# Altium project GN-1846-E-V2_HI3531A.PRJPCB (part 5 of 5)
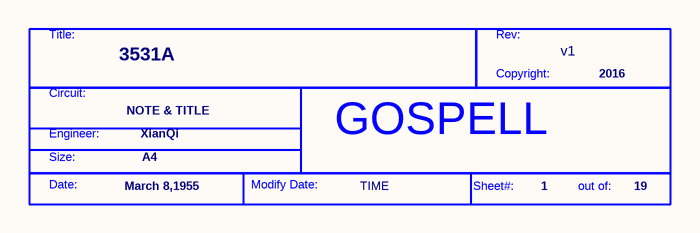
[diagram p117: P01 NOTE $ TITLE.SchDoc]

### Notes on the sheet
- (in symbol GOSPELL) Title:; Rev:; Copyright:; Circuit:; Engineer:; Size:; Date:; Modify Date:; Sheet#:; out of:

## Nets that join several sheets
1V5: P10 DDRC&D NOVTT (73 pins), P09 DDRA&B NOVTT (74 pins), P08 Hi3531AV100(DDRC0 D (42 pins), P05 Power Supply2 (7 pins)
3V3: P17 Hi3531AV100 (AD) (12 pins), P16 Hi3531AV100(RGMII&I (5 pins), P15 Hi3531AV100(VO&I2S3 (7 pins), P14 Hi3531AV100(SATA&PC (5 pins), P13 Configuration (13 pins), P12 SPI&NAND FLASH (6 pins), P11 Hi3531A(SYSTEM)&RES (18 pins), P08 Hi3531AV100(DDRC0 D (LB1.1 LB2.1), P07 Hi3531AV100(POWER) (22 pins), P05 Power Supply2 (8 pins), P04 Power Supply1 (R35.1)
12V0: P05 Power Supply2 (8 pins), P04 Power Supply1 (17 pins)
12V0IN: P18 CONNECT DDR1 (6 pins), P04 Power Supply1 (F1.1)
DDR0_A0: P09 DDRA&B NOVTT (U15.N3 U37.N3), P08 Hi3531AV100(DDRC0 D (U8.AE3)
DDR0_A1: P09 DDRA&B NOVTT (U15.P7 U37.P7), P08 Hi3531AV100(DDRC0 D (U8.AG3)
DDR0_A2: P09 DDRA&B NOVTT (U15.P3 U37.P3), P08 Hi3531AV100(DDRC0 D (U8.AK2)
DDR0_A3: P09 DDRA&B NOVTT (U15.N2 U37.N2), P08 Hi3531AV100(DDRC0 D (U8.AH3)
DDR0_A4: P09 DDRA&B NOVTT (U15.P8 U37.P8), P08 Hi3531AV100(DDRC0 D (U8.AF4)
DDR0_A5: P09 DDRA&B NOVTT (U15.P2 U37.P2), P08 Hi3531AV100(DDRC0 D (U8.AJ1)
DDR0_A6: P09 DDRA&B NOVTT (U15.R8 U37.R8), P08 Hi3531AV100(DDRC0 D (U8.AF5)
DDR0_A7: P09 DDRA&B NOVTT (U15.R2 U37.R2), P08 Hi3531AV100(DDRC0 D (U8.AK1)
DDR0_A8: P09 DDRA&B NOVTT (U15.T8 U37.T8), P08 Hi3531AV100(DDRC0 D (U8.AJ3)
DDR0_A9: P09 DDRA&B NOVTT (U15.R3 U37.R3), P08 Hi3531AV100(DDRC0 D (U8.AK3)
DDR0_A10: P09 DDRA&B NOVTT (U15.L7 U37.L7), P08 Hi3531AV100(DDRC0 D (U8.AD6)
DDR0_A11: P09 DDRA&B NOVTT (U15.R7 U37.R7), P08 Hi3531AV100(DDRC0 D (U8.AG4)
DDR0_A12: P09 DDRA&B NOVTT (U15.N7 U37.N7), P08 Hi3531AV100(DDRC0 D (U8.AE5)
DDR0_A13: P09 DDRA&B NOVTT (U15.T3 U37.T3), P08 Hi3531AV100(DDRC0 D (U8.AM1)
DDR0_A14: P09 DDRA&B NOVTT (U15.T7 U37.T7), P08 Hi3531AV100(DDRC0 D (U8.AJ4)
DDR0_A15: P09 DDRA&B NOVTT (U15.M7 U37.M7), P08 Hi3531AV100(DDRC0 D (U8.AE6)
DDR0_BA0: P09 DDRA&B NOVTT (U15.M2 U37.M2), P08 Hi3531AV100(DDRC0 D (U8.AL2)
DDR0_BA1: P09 DDRA&B NOVTT (U15.N8 U37.N8), P08 Hi3531AV100(DDRC0 D (U8.AF1)
DDR0_BA2: P09 DDRA&B NOVTT (U15.M3 U37.M3), P08 Hi3531AV100(DDRC0 D (U8.AH1)
DDR0_CAS_N: P09 DDRA&B NOVTT (U15.K3 U37.K3), P08 Hi3531AV100(DDRC0 D (U8.AD5)
DDR0_CKE: P09 DDRA&B NOVTT (U15.K9 U37.K9), P08 Hi3531AV100(DDRC0 D (U8.AF2)
DDR0_CLK0_N: P09 DDRA&B NOVTT (R292.2 U15.K7 U37.K7), P08 Hi3531AV100(DDRC0 D (U8.AE1)
DDR0_CLK0_P: P09 DDRA&B NOVTT (R292.1 U15.J7 U37.J7), P08 Hi3531AV100(DDRC0 D (U8.AE2)
DDR0_CS_N: P09 DDRA&B NOVTT (R267.1 R268.2 U15.L2 U37.L2), P08 Hi3531AV100(DDRC0 D (U8.AG1)
DDR0_DM0: P09 DDRA&B NOVTT (U15.E7), P08 Hi3531AV100(DDRC0 D (U8.R4)
DDR0_DM1: P09 DDRA&B NOVTT (U15.D3), P08 Hi3531AV100(DDRC0 D (U8.N3)
DDR0_DM2: P09 DDRA&B NOVTT (U37.E7), P08 Hi3531AV100(DDRC0 D (U8.AA5)
DDR0_DM3: P09 DDRA&B NOVTT (U37.D3), P08 Hi3531AV100(DDRC0 D (U8.W6)
DDR0_DQ0: P09 DDRA&B NOVTT (U15.E3), P08 Hi3531AV100(DDRC0 D (U8.M5)
DDR0_DQ1: P09 DDRA&B NOVTT (U15.F7), P08 Hi3531AV100(DDRC0 D (U8.R5)
DDR0_DQ2: P09 DDRA&B NOVTT (U15.F2), P08 Hi3531AV100(DDRC0 D (U8.N5)
DDR0_DQ3: P09 DDRA&B NOVTT (U15.F8), P08 Hi3531AV100(DDRC0 D (U8.U6)
DDR0_DQ4: P09 DDRA&B NOVTT (U15.H3), P08 Hi3531AV100(DDRC0 D (U8.P6)
DDR0_DQ5: P09 DDRA&B NOVTT (U15.H8), P08 Hi3531AV100(DDRC0 D (U8.U3)
DDR0_DQ6: P09 DDRA&B NOVTT (U15.G2), P08 Hi3531AV100(DDRC0 D (U8.N4)
DDR0_DQ7: P09 DDRA&B NOVTT (U15.H7), P08 Hi3531AV100(DDRC0 D (U8.P4)
DDR0_DQ8: P09 DDRA&B NOVTT (U15.D7), P08 Hi3531AV100(DDRC0 D (U8.T5)
DDR0_DQ9: P09 DDRA&B NOVTT (U15.C3), P08 Hi3531AV100(DDRC0 D (U8.N1)
DDR0_DQ10: P09 DDRA&B NOVTT (U15.C8), P08 Hi3531AV100(DDRC0 D (U8.U4)
DDR0_DQ11: P09 DDRA&B NOVTT (U15.C2), P08 Hi3531AV100(DDRC0 D (U8.M6)
DDR0_DQ12: P09 DDRA&B NOVTT (U15.A7), P08 Hi3531AV100(DDRC0 D (U8.T2)
DDR0_DQ13: P09 DDRA&B NOVTT (U15.A2), P08 Hi3531AV100(DDRC0 D (U8.M1)
DDR0_DQ14: P09 DDRA&B NOVTT (U15.B8), P08 Hi3531AV100(DDRC0 D (U8.U1)
DDR0_DQ15: P09 DDRA&B NOVTT (U15.A3), P08 Hi3531AV100(DDRC0 D (U8.M2)
DDR0_DQ16: P09 DDRA&B NOVTT (U37.E3), P08 Hi3531AV100(DDRC0 D (U8.W5)
DDR0_DQ17: P09 DDRA&B NOVTT (U37.F7), P08 Hi3531AV100(DDRC0 D (U8.Y4)
DDR0_DQ18: P09 DDRA&B NOVTT (U37.F2), P08 Hi3531AV100(DDRC0 D (U8.V2)
DDR0_DQ19: P09 DDRA&B NOVTT (U37.F8), P08 Hi3531AV100(DDRC0 D (U8.AB6)
DDR0_DQ20: P09 DDRA&B NOVTT (U37.H3), P08 Hi3531AV100(DDRC0 D (U8.V6)
DDR0_DQ21: P09 DDRA&B NOVTT (U37.H8), P08 Hi3531AV100(DDRC0 D (U8.AD1)
DDR0_DQ22: P09 DDRA&B NOVTT (U37.G2), P08 Hi3531AV100(DDRC0 D (U8.V1)
DDR0_DQ23: P09 DDRA&B NOVTT (U37.H7), P08 Hi3531AV100(DDRC0 D (U8.Y6)
DDR0_DQ24: P09 DDRA&B NOVTT (U37.D7), P08 Hi3531AV100(DDRC0 D (U8.AB4)
DDR0_DQ25: P09 DDRA&B NOVTT (U37.C3), P08 Hi3531AV100(DDRC0 D (U8.V5)
DDR0_DQ26: P09 DDRA&B NOVTT (U37.C8), P08 Hi3531AV100(DDRC0 D (U8.AB2)
DDR0_DQ27: P09 DDRA&B NOVTT (U37.C2), P08 Hi3531AV100(DDRC0 D (U8.W2)
DDR0_DQ28: P09 DDRA&B NOVTT (U37.A7), P08 Hi3531AV100(DDRC0 D (U8.AC1)
DDR0_DQ29: P09 DDRA&B NOVTT (U37.A2), P08 Hi3531AV100(DDRC0 D (U8.W3)
DDR0_DQ30: P09 DDRA&B NOVTT (U37.B8), P08 Hi3531AV100(DDRC0 D (U8.AC2)
DDR0_DQ31: P09 DDRA&B NOVTT (U37.A3), P08 Hi3531AV100(DDRC0 D (U8.W4)
DDR0_DQS0_N: P09 DDRA&B NOVTT (U15.G3), P08 Hi3531AV100(DDRC0 D (U8.P2)
DDR0_DQS0_P: P09 DDRA&B NOVTT (U15.F3), P08 Hi3531AV100(DDRC0 D (U8.P1)
DDR0_DQS1_N: P09 DDRA&B NOVTT (U15.B7), P08 Hi3531AV100(DDRC0 D (U8.R3)
DDR0_DQS1_P: P09 DDRA&B NOVTT (U15.C7), P08 Hi3531AV100(DDRC0 D (U8.R2)
DDR0_DQS2_N: P09 DDRA&B NOVTT (U37.G3), P08 Hi3531AV100(DDRC0 D (U8.Y2)
DDR0_DQS2_P: P09 DDRA&B NOVTT (U37.F3), P08 Hi3531AV100(DDRC0 D (U8.Y1)
DDR0_DQS3_N: P09 DDRA&B NOVTT (U37.B7), P08 Hi3531AV100(DDRC0 D (U8.AA3)
DDR0_DQS3_P: P09 DDRA&B NOVTT (U37.C7), P08 Hi3531AV100(DDRC0 D (U8.AA2)
DDR0_ODT: P09 DDRA&B NOVTT (R269.1 R270.2 U15.K1 U37.K1), P08 Hi3531AV100(DDRC0 D (U8.AH2)
DDR0_RAS_N: P09 DDRA&B NOVTT (U15.J3 U37.J3), P08 Hi3531AV100(DDRC0 D (U8.AG2)
DDR0_RESET_N: P09 DDRA&B NOVTT (C471.1 R235.2 U15.T2 U37.T2), P08 Hi3531AV100(DDRC0 D (U8.AL1)
DDR0_WE_N: P09 DDRA&B NOVTT (U15.L3 U37.L3), P08 Hi3531AV100(DDRC0 D (U8.AD4)
DDR1_A0: P10 DDRC&D NOVTT (U38.N3 U39.N3), P08 Hi3531AV100(DDRC0 D (U8.AH17)
DDR1_A1: P10 DDRC&D NOVTT (U38.P7 U39.P7), P08 Hi3531AV100(DDRC0 D (U8.AK19)
DDR1_A2: P10 DDRC&D NOVTT (U38.P3 U39.P3), P08 Hi3531AV100(DDRC0 D (U8.AM20)
DDR1_A3: P10 DDRC&D NOVTT (U38.N2 U39.N2), P08 Hi3531AV100(DDRC0 D (U8.AM19)
DDR1_A4: P10 DDRC&D NOVTT (U38.P8 U39.P8), P08 Hi3531AV100(DDRC0 D (U8.AH19)
DDR1_A5: P10 DDRC&D NOVTT (U38.P2 U39.P2), P08 Hi3531AV100(DDRC0 D (U8.AL20)
DDR1_A6: P10 DDRC&D NOVTT (U38.R8 U39.R8), P08 Hi3531AV100(DDRC0 D (U8.AJ19)
DDR1_A7: P10 DDRC&D NOVTT (U38.R2 U39.R2), P08 Hi3531AV100(DDRC0 D (U8.AL21)
DDR1_A8: P10 DDRC&D NOVTT (U38.T8 U39.T8), P08 Hi3531AV100(DDRC0 D (U8.AH20)
DDR1_A9: P10 DDRC&D NOVTT (U38.R3 U39.R3), P08 Hi3531AV100(DDRC0 D (U8.AN21)
DDR1_A10: P10 DDRC&D NOVTT (U38.L7 U39.L7), P08 Hi3531AV100(DDRC0 D (U8.AK16)
DDR1_A11: P10 DDRC&D NOVTT (U38.R7 U39.R7), P08 Hi3531AV100(DDRC0 D (U8.AL19)
DDR1_A12: P10 DDRC&D NOVTT (U38.N7 U39.N7), P08 Hi3531AV100(DDRC0 D (U8.AJ17)
DDR1_A13: P10 DDRC&D NOVTT (U38.T3 U39.T3), P08 Hi3531AV100(DDRC0 D (U8.AM22)
DDR1_A14: P10 DDRC&D NOVTT (U38.T7 U39.T7), P08 Hi3531AV100(DDRC0 D (U8.AJ21)
DDR1_A15: P10 DDRC&D NOVTT (U38.M7 U39.M7), P08 Hi3531AV100(DDRC0 D (U8.AK17)
DDR1_BA0: P10 DDRC&D NOVTT (U38.M2 U39.M2), P08 Hi3531AV100(DDRC0 D (U8.AN22)
DDR1_BA1: P10 DDRC&D NOVTT (U38.N8 U39.N8), P08 Hi3531AV100(DDRC0 D (U8.AN17)
DDR1_BA2: P10 DDRC&D NOVTT (U38.M3 U39.M3), P08 Hi3531AV100(DDRC0 D (U8.AN19)
DDR1_CAS_N: P10 DDRC&D NOVTT (U38.K3 U39.K3), P08 Hi3531AV100(DDRC0 D (U8.AK15)
DDR1_CKE: P10 DDRC&D NOVTT (U38.K9 U39.K9), P08 Hi3531AV100(DDRC0 D (U8.AM17)
DDR1_CLK0_N: P10 DDRC&D NOVTT (R293.2 U38.K7 U39.K7), P08 Hi3531AV100(DDRC0 D (U8.AN16)
DDR1_CLK0_P: P10 DDRC&D NOVTT (R293.1 U38.J7 U39.J7), P08 Hi3531AV100(DDRC0 D (U8.AM16)
DDR1_CS_N: P10 DDRC&D NOVTT (R273.1 R274.2 U38.L2 U39.L2), P08 Hi3531AV100(DDRC0 D (U8.AN18)
DDR1_DM0: P10 DDRC&D NOVTT (U38.E7), P08 Hi3531AV100(DDRC0 D (U8.AH8)
DDR1_DM1: P10 DDRC&D NOVTT (U38.D3), P08 Hi3531AV100(DDRC0 D (U8.AN4)
DDR1_DM2: P10 DDRC&D NOVTT (U39.E7), P08 Hi3531AV100(DDRC0 D (U8.AK13)
DDR1_DM3: P10 DDRC&D NOVTT (U39.D3), P08 Hi3531AV100(DDRC0 D (U8.AK11)
DDR1_DQ0: P10 DDRC&D NOVTT (U38.E3), P08 Hi3531AV100(DDRC0 D (U8.AL4)
DDR1_DQ1: P10 DDRC&D NOVTT (U38.F7), P08 Hi3531AV100(DDRC0 D (U8.AK7)
DDR1_DQ2: P10 DDRC&D NOVTT (U38.F2), P08 Hi3531AV100(DDRC0 D (U8.AK5)
DDR1_DQ3: P10 DDRC&D NOVTT (U38.F8), P08 Hi3531AV100(DDRC0 D (U8.AM8)
DDR1_DQ4: P10 DDRC&D NOVTT (U38.H3), P08 Hi3531AV100(DDRC0 D (U8.AK6)
DDR1_DQ5: P10 DDRC&D NOVTT (U38.H8), P08 Hi3531AV100(DDRC0 D (U8.AN8)
DDR1_DQ6: P10 DDRC&D NOVTT (U38.G2), P08 Hi3531AV100(DDRC0 D (U8.AJ6)
DDR1_DQ7: P10 DDRC&D NOVTT (U38.H7), P08 Hi3531AV100(DDRC0 D (U8.AJ7)
DDR1_DQ8: P10 DDRC&D NOVTT (U38.D7), P08 Hi3531AV100(DDRC0 D (U8.AK8)
DDR1_DQ9: P10 DDRC&D NOVTT (U38.C3), P08 Hi3531AV100(DDRC0 D (U8.AM3)
DDR1_DQ10: P10 DDRC&D NOVTT (U38.C8), P08 Hi3531AV100(DDRC0 D (U8.AJ9)
DDR1_DQ11: P10 DDRC&D NOVTT (U38.C2), P08 Hi3531AV100(DDRC0 D (U8.AN2)
DDR1_DQ12: P10 DDRC&D NOVTT (U38.A7), P08 Hi3531AV100(DDRC0 D (U8.AN7)
DDR1_DQ13: P10 DDRC&D NOVTT (U38.A2), P08 Hi3531AV100(DDRC0 D (U8.AL3)
DDR1_DQ14: P10 DDRC&D NOVTT (U38.B8), P08 Hi3531AV100(DDRC0 D (U8.AK9)
DDR1_DQ15: P10 DDRC&D NOVTT (U38.A3), P08 Hi3531AV100(DDRC0 D (U8.AN3)
DDR1_DQ16: P10 DDRC&D NOVTT (U39.E3), P08 Hi3531AV100(DDRC0 D (U8.AJ11)
DDR1_DQ17: P10 DDRC&D NOVTT (U39.F7), P08 Hi3531AV100(DDRC0 D (U8.AH12)
DDR1_DQ18: P10 DDRC&D NOVTT (U39.F2), P08 Hi3531AV100(DDRC0 D (U8.AM9)
DDR1_DQ19: P10 DDRC&D NOVTT (U39.F8), P08 Hi3531AV100(DDRC0 D (U8.AJ13)
DDR1_DQ20: P10 DDRC&D NOVTT (U39.H3), P08 Hi3531AV100(DDRC0 D (U8.AJ10)
DDR1_DQ21: P10 DDRC&D NOVTT (U39.H8), P08 Hi3531AV100(DDRC0 D (U8.AN15)
DDR1_DQ22: P10 DDRC&D NOVTT (U39.G2), P08 Hi3531AV100(DDRC0 D (U8.AL8)
DDR1_DQ23: P10 DDRC&D NOVTT (U39.H7), P08 Hi3531AV100(DDRC0 D (U8.AK12)
DDR1_DQ24: P10 DDRC&D NOVTT (U39.D7), P08 Hi3531AV100(DDRC0 D (U8.AH14)
DDR1_DQ25: P10 DDRC&D NOVTT (U39.C3), P08 Hi3531AV100(DDRC0 D (U8.AH11)
DDR1_DQ26: P10 DDRC&D NOVTT (U39.C8), P08 Hi3531AV100(DDRC0 D (U8.AM14)
DDR1_DQ27: P10 DDRC&D NOVTT (U39.C2), P08 Hi3531AV100(DDRC0 D (U8.AN10)
DDR1_DQ28: P10 DDRC&D NOVTT (U39.A7), P08 Hi3531AV100(DDRC0 D (U8.AN14)
DDR1_DQ29: P10 DDRC&D NOVTT (U39.A2), P08 Hi3531AV100(DDRC0 D (U8.AL9)
DDR1_DQ30: P10 DDRC&D NOVTT (U39.B8), P08 Hi3531AV100(DDRC0 D (U8.AL14)
DDR1_DQ31: P10 DDRC&D NOVTT (U39.A3), P08 Hi3531AV100(DDRC0 D (U8.AM10)
DDR1_DQS0_N: P10 DDRC&D NOVTT (U38.G3), P08 Hi3531AV100(DDRC0 D (U8.AM5)
DDR1_DQS0_P: P10 DDRC&D NOVTT (U38.F3), P08 Hi3531AV100(DDRC0 D (U8.AN5)
DDR1_DQS1_N: P10 DDRC&D NOVTT (U38.B7), P08 Hi3531AV100(DDRC0 D (U8.AL6)
DDR1_DQS1_P: P10 DDRC&D NOVTT (U38.C7), P08 Hi3531AV100(DDRC0 D (U8.AM6)
DDR1_DQS2_N: P10 DDRC&D NOVTT (U39.G3), P08 Hi3531AV100(DDRC0 D (U8.AM11)
DDR1_DQS2_P: P10 DDRC&D NOVTT (U39.F3), P08 Hi3531AV100(DDRC0 D (U8.AN11)
DDR1_DQS3_N: P10 DDRC&D NOVTT (U39.B7), P08 Hi3531AV100(DDRC0 D (U8.AL12)
DDR1_DQS3_P: P10 DDRC&D NOVTT (U39.C7), P08 Hi3531AV100(DDRC0 D (U8.AM12)
DDR1_ODT: P10 DDRC&D NOVTT (R271.1 R272.2 U38.K1 U39.K1), P08 Hi3531AV100(DDRC0 D (U8.AL18)
DDR1_RAS_N: P10 DDRC&D NOVTT (U38.J3 U39.J3), P08 Hi3531AV100(DDRC0 D (U8.AM18)
DDR1_RESET_N: P10 DDRC&D NOVTT (C472.1 R236.2 U38.T2 U39.T2), P08 Hi3531AV100(DDRC0 D (U8.AM21)
DDR1_WE_N: P10 DDRC&D NOVTT (U38.L3 U39.L3), P08 Hi3531AV100(DDRC0 D (U8.AJ15)
DVDD_CORE: P15 Hi3531AV100(VO&I2S3 (LB14.1), P14 Hi3531AV100(SATA&PC (LB3.1 LB6.1), P07 Hi3531AV100(POWER) (40 pins), P04 Power Supply1 (7 pins)
DVDD_CPU: P07 Hi3531AV100(POWER) (28 pins), P04 Power Supply1 (7 pins)
EPHY_CLK/BOOT_SEL0: P16 Hi3531AV100(RGMII&I (R59.2 U8.A9), P13 Configuration (R2.1 R80.1)
GND: P18 CONNECT DDR1 (40 pins), P17 Hi3531AV100 (AD) (C153.2 C175.2 C199.2 C430.2), P16 Hi3531AV100(RGMII&I (C198.2 C200.2 C431.2 R326.1), P15 Hi3531AV100(VO&I2S3 (31 pins), P14 Hi3531AV100(SATA&PC (44 pins), P13 Configuration (8 pins), P12 SPI&NAND FLASH (6 pins), P11 Hi3531A(SYSTEM)&RES (29 pins), P10 DDRC&D NOVTT (81 pins), P09 DDRA&B NOVTT (82 pins), P08 Hi3531AV100(DDRC0 D (30 pins), P07 Hi3531AV100(POWER) (40 pins), P06 Hi3531AV100(GND) (262 pins), P05 Power Supply2 (20 pins), P04 Power Supply1 (33 pins)
I2S2_MCLK/BOOT_SEL1: P16 Hi3531AV100(RGMII&I (R60.1 U8.U31), P13 Configuration (R248.2 R323.1)
I2S2_SD_TX/SLAVE_MODE: P16 Hi3531AV100(RGMII&I (U8.U28), P13 Configuration (R7.1 R82.1)
I2S3_SD_TX/PCIE_REFCLK_SEL: P15 Hi3531AV100(VO&I2S3 (U8.D24), P13 Configuration (R368.1 R703.1)
JTAG_EN: P13 Configuration (R246.1), P11 Hi3531A(SYSTEM)&RES (U8.AK22)
MDCK/BOOTROM_SEL: P16 Hi3531AV100(RGMII&I (R105.2 U8.B8), P13 Configuration (R688.1 R689.1)
POR_ENABLE: P13 Configuration (R244.2 R321.1), P11 Hi3531A(SYSTEM)&RES (U8.AH24)
SFC_CLK: P12 SPI&NAND FLASH (U5.6 U20.16), P11 Hi3531A(SYSTEM)&RES (R64.2)
SFC_CLK/SFC_BOOT_MODE: P13 Configuration (R690.1 R691.1), P11 Hi3531A(SYSTEM)&RES (R64.1 U8.AD29)
SFC_CS0N: P12 SPI&NAND FLASH (R130.2 U5.1 U20.7), P11 Hi3531A(SYSTEM)&RES (U8.AD33)
SFC_DEVICE_MODE: P16 Hi3531AV100(RGMII&I (U8.D8), P13 Configuration (R245.2 R322.1)
SFC_DIO_IO0: P12 SPI&NAND FLASH (U5.5 U20.15), P11 Hi3531A(SYSTEM)&RES (U8.AD30)
SFC_DOI_IO1: P12 SPI&NAND FLASH (U5.2 U20.8), P11 Hi3531A(SYSTEM)&RES (U8.AC29)
SFC_HOLD_IO3: P12 SPI&NAND FLASH (R29.2 R127.2 U20.1), P11 Hi3531A(SYSTEM)&RES (U8.AC28)
SFC_WP_IO2: P12 SPI&NAND FLASH (R131.1 U5.3 U20.9), P11 Hi3531A(SYSTEM)&RES (U8.AC30)
SPI_CSN0/PCIE_SATA_MODE0: P17 Hi3531AV100 (AD) (R222.2 U8.R29), P13 Configuration (R319.1)
SPI_CSN1/PCIE_SATA_MODE1: P17 Hi3531AV100 (AD) (U8.T29), P13 Configuration (R318.1)
SPI_CSN2/PCIE_SATA_MODE2: P17 Hi3531AV100 (AD) (U8.T30), P13 Configuration (R317.1)
SPI_CSN3/PCIE_SATA_MODE3: P17 Hi3531AV100 (AD) (U8.T28), P13 Configuration (R316.1)
SYS_RSTN: P12 SPI&NAND FLASH (R56.2 U20.3), P11 Hi3531A(SYSTEM)&RES (5 pins)
EPHY_CLK: P18 CONNECT DDR1 (J41.164), P16 Hi3531AV100(RGMII&I (R59.1)
EPHY_RSTN: P18 CONNECT DDR1 (J41.172), P16 Hi3531AV100(RGMII&I (R326.2 U8.B6)
F_SPI_CLK: P18 CONNECT DDR1 (R134.1), P17 Hi3531AV100 (AD) (R221.2 U8.R31)
F_SPI_CS: P18 CONNECT DDR1 (J41.7), P17 Hi3531AV100 (AD) (R222.1)
F_SPI_DI: P18 CONNECT DDR1 (R133.1), P17 Hi3531AV100 (AD) (U8.R32)
F_SPI_DO: P18 CONNECT DDR1 (R132.1), P17 Hi3531AV100 (AD) (R325.2 U8.R33)
FA_I2S_BCLK: P18 CONNECT DDR1 (R57.2), P17 Hi3531AV100 (AD) (U8.F28)
FA_I2S_DA0: P18 CONNECT DDR1 (R58.2), P17 Hi3531AV100 (AD) (U8.E29)
FA_I2S_LRCLK: P18 CONNECT DDR1 (R55.2), P17 Hi3531AV100 (AD) (U8.D30)
FB_I2S_BCLK: P18 CONNECT DDR1 (R62.2), P17 Hi3531AV100 (AD) (U8.K28)
FB_I2S_DA0: P18 CONNECT DDR1 (R63.2), P17 Hi3531AV100 (AD) (U8.L29)
FB_I2S_LRCLK: P18 CONNECT DDR1 (R61.2), P17 Hi3531AV100 (AD) (U8.K29)
FC_I2S_BCLK: P18 CONNECT DDR1 (R128.1), P16 Hi3531AV100(RGMII&I (U8.U29)
FC_I2S_DA0: P18 CONNECT DDR1 (R129.1), P16 Hi3531AV100(RGMII&I (U8.V30)
FC_I2S_LRCLK: P18 CONNECT DDR1 (R119.1), P16 Hi3531AV100(RGMII&I (U8.V28)
G0_A1_656_CLK: P18 CONNECT DDR1 (J41.102), P17 Hi3531AV100 (AD) (U8.B26)
G0_A1_I2C_CLK: P18 CONNECT DDR1 (R102.1), P15 Hi3531AV100(VO&I2S3 (U8.E16)
G0_A1_I2C_SDA: P18 CONNECT DDR1 (R103.1), P15 Hi3531AV100(VO&I2S3 (U8.D16)
G0_A2_656_CLK: P18 CONNECT DDR1 (J41.101), P17 Hi3531AV100 (AD) (U8.C28)
G0_A2_I2C_CLK: P18 CONNECT DDR1 (R100.1), P15 Hi3531AV100(VO&I2S3 (U8.E15)
G0_A2_I2C_SDA: P18 CONNECT DDR1 (R101.1), P15 Hi3531AV100(VO&I2S3 (U8.C16)
G1_A1_656_CLK: P18 CONNECT DDR1 (J41.82), P17 Hi3531AV100 (AD) (U8.A32)
G1_A1_I2C_CLK: P18 CONNECT DDR1 (R122.1), P15 Hi3531AV100(VO&I2S3 (U8.D17)
G1_A1_I2C_SDA: P18 CONNECT DDR1 (R125.1), P15 Hi3531AV100(VO&I2S3 (U8.E17)
G1_A2_656_CLK: P18 CONNECT DDR1 (J41.81), P17 Hi3531AV100 (AD) (U8.E32)
G1_A2_I2C_CLK: P18 CONNECT DDR1 (R121.1), P15 Hi3531AV100(VO&I2S3 (U8.B22)
G1_A2_I2C_SDA: P18 CONNECT DDR1 (R120.1), P15 Hi3531AV100(VO&I2S3 (U8.B23)
G2_A1_656_CLK: P18 CONNECT DDR1 (J41.56), P17 Hi3531AV100 (AD) (U8.H32)
G2_A1_I2C_CLK: P18 CONNECT DDR1 (R124.1), P16 Hi3531AV100(RGMII&I (U8.D19)
G2_A1_I2C_SDA: P18 CONNECT DDR1 (R123.1), P16 Hi3531AV100(RGMII&I (U8.E19)
G2_A2_656_CLK: P18 CONNECT DDR1 (J41.55), P17 Hi3531AV100 (AD) (U8.J31)
G2_A2_I2C_CLK: P18 CONNECT DDR1 (R114.1), P15 Hi3531AV100(VO&I2S3 (U8.E24)
G2_A2_I2C_SDA: P18 CONNECT DDR1 (R126.1), P15 Hi3531AV100(VO&I2S3 (U8.F24)
G3_A1_656_CLK: P18 CONNECT DDR1 (J41.14), P17 Hi3531AV100 (AD) (U8.M32)
G3_A1_I2C_CLK: P18 CONNECT DDR1 (R116.1), P15 Hi3531AV100(VO&I2S3 (U8.E22)
G3_A1_I2C_SDA: P18 CONNECT DDR1 (R115.1), P15 Hi3531AV100(VO&I2S3 (U8.E23)
G3_A2_656_CLK: P18 CONNECT DDR1 (J41.13), P17 Hi3531AV100 (AD) (U8.P33)
G3_A2_I2C_CLK: P18 CONNECT DDR1 (R113.1), P15 Hi3531AV100(VO&I2S3 (U8.F22)
G3_A2_I2C_SDA: P18 CONNECT DDR1 (R111.1), P15 Hi3531AV100(VO&I2S3 (U8.E21)
MDCK: P18 CONNECT DDR1 (J41.168), P16 Hi3531AV100(RGMII&I (R105.1)
MDIO: P18 CONNECT DDR1 (J41.170), P16 Hi3531AV100(RGMII&I (U8.C9)
NetC1_1: P18 CONNECT DDR1 (J41.201), P15 Hi3531AV100(VO&I2S3 (C1.1 J15.3 R48.2)
NetC2_1: P18 CONNECT DDR1 (J41.203), P15 Hi3531AV100(VO&I2S3 (C2.1 J15.2 R372.2)
NetJ41_2: P18 CONNECT DDR1 (J41.2), P16 Hi3531AV100(RGMII&I (R60.2)
NetR4_1: P18 CONNECT DDR1 (R4.1), P15 Hi3531AV100(VO&I2S3 (U8.K2)
NetR5_1: P18 CONNECT DDR1 (R5.1), P15 Hi3531AV100(VO&I2S3 (U8.H3)
NetR6_1: P18 CONNECT DDR1 (R6.1), P15 Hi3531AV100(VO&I2S3 (U8.G3)
NetR9_1: P18 CONNECT DDR1 (R9.1), P15 Hi3531AV100(VO&I2S3 (U8.E2)
NetR10_1: P18 CONNECT DDR1 (R10.1), P15 Hi3531AV100(VO&I2S3 (U8.K1)
NetR104_1: P18 CONNECT DDR1 (R104.1), P15 Hi3531AV100(VO&I2S3 (U8.A21)
NetR108_1: P18 CONNECT DDR1 (R108.1), P15 Hi3531AV100(VO&I2S3 (U8.C20)
NetR109_1: P18 CONNECT DDR1 (R109.1), P15 Hi3531AV100(VO&I2S3 (U8.B20)
NetR110_1: P18 CONNECT DDR1 (R110.1), P15 Hi3531AV100(VO&I2S3 (U8.C21)
NetR112_1: P18 CONNECT DDR1 (R112.1), P15 Hi3531AV100(VO&I2S3 (U8.B21)
PWM_SVB0_CPU: P11 Hi3531A(SYSTEM)&RES (U8.C1), P04 Power Supply1 (R297.2)
PWM_SVB1_CORE: P11 Hi3531A(SYSTEM)&RES (U8.D2), P04 Power Supply1 (R296.2)
RGMII_RXCK: P18 CONNECT DDR1 (J41.146), P16 Hi3531AV100(RGMII&I (U8.B3)
RGMII_RXD0: P18 CONNECT DDR1 (J41.138), P16 Hi3531AV100(RGMII&I (U8.C2)
RGMII_RXD1: P18 CONNECT DDR1 (J41.140), P16 Hi3531AV100(RGMII&I (U8.A2)
RGMII_RXD2: P18 CONNECT DDR1 (J41.142), P16 Hi3531AV100(RGMII&I (U8.B2)
RGMII_RXD3: P18 CONNECT DDR1 (J41.144), P16 Hi3531AV100(RGMII&I (U8.D3)
RGMII_RXDV: P18 CONNECT DDR1 (J41.148), P16 Hi3531AV100(RGMII&I (U8.B1)
RGMII_TXCKOUT: P18 CONNECT DDR1 (J41.160), P16 Hi3531AV100(RGMII&I (R320.1)
RGMII_TXD0: P18 CONNECT DDR1 (J41.152), P16 Hi3531AV100(RGMII&I (R342.1)
RGMII_TXD1: P18 CONNECT DDR1 (J41.154), P16 Hi3531AV100(RGMII&I (R343.1)
RGMII_TXD2: P18 CONNECT DDR1 (J41.156), P16 Hi3531AV100(RGMII&I (R344.1)
RGMII_TXD3: P18 CONNECT DDR1 (J41.158), P16 Hi3531AV100(RGMII&I (R341.1)
RGMII_TXEN: P18 CONNECT DDR1 (J41.162), P16 Hi3531AV100(RGMII&I (R345.1)
UART1_RXD: P18 CONNECT DDR1 (J41.105), P15 Hi3531AV100(VO&I2S3 (U8.E20)
UART1_TXD: P18 CONNECT DDR1 (J41.107), P15 Hi3531AV100(VO&I2S3 (U8.D20)